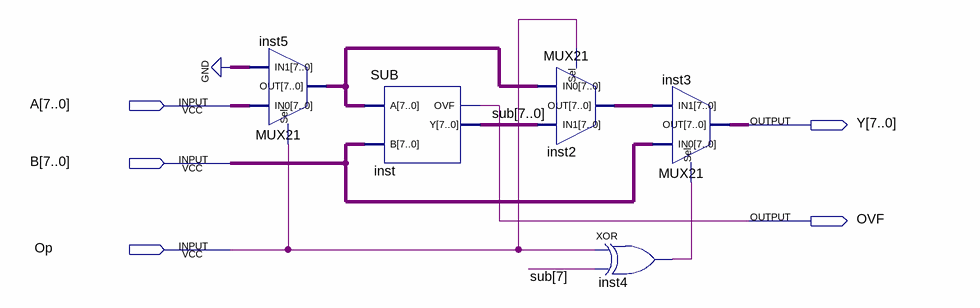
[diagram p0: schematic sheet]
// Quartus schematic AU2.bdf as structural Verilog: 5 symbols, 5 pins
module AU2 (
  input  [7:0] A,
  input  [7:0] B,
  input  Op,
  output [7:0] Y,
  output OVF
);

  wire inst4_out;
  wire [7:0] inst2_out, inst5_out, sub;

  MUX21 inst5 (.Sel(Op), .IN0(A), .IN1({8{1'b0}}), .OUT(inst5_out));
  SUB inst (.A(inst5_out), .B(B), .Y(sub), .OVF(OVF));
  MUX21 inst2 (.Sel(Op), .IN0(inst5_out), .IN1(sub), .OUT(inst2_out));
  xor inst4 (inst4_out, Op, sub[7]);
  MUX21 inst3 (.Sel(inst4_out), .IN0(B), .IN1(inst2_out), .OUT(Y));
endmodule
